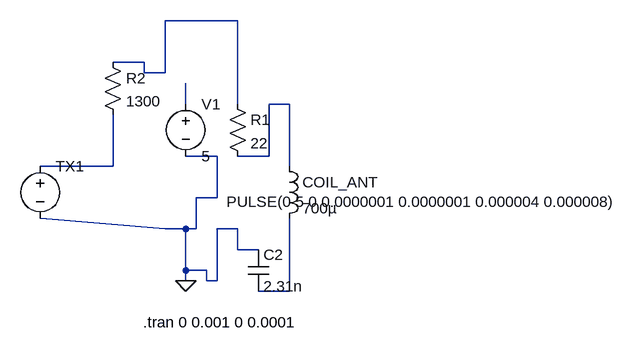
[diagram p0: schematic RLC_Imp.asc]
RLC_Imp.asc, the LTspice schematic file:
Version 4
SHEET 1 1072 680
WIRE 160 -224 48 -224
WIRE 16 -160 -32 -160
WIRE 16 -144 16 -160
WIRE 48 -144 48 -224
WIRE 48 -144 16 -144
WIRE 80 -96 80 -128
WIRE 160 -96 160 -224
WIRE 240 -96 208 -96
WIRE 128 -16 80 -16
WIRE 208 -16 208 -96
WIRE 208 -16 160 -16
WIRE -32 0 -32 -80
WIRE -32 0 -144 0
WIRE 240 0 240 -96
WIRE 128 48 128 -16
WIRE 128 48 96 48
WIRE 48 96 -144 80
WIRE 80 96 48 96
WIRE 96 96 96 48
WIRE 96 96 80 96
WIRE 160 96 128 96
WIRE 160 128 160 96
WIRE 192 128 160 128
WIRE 80 160 80 96
WIRE 112 160 80 160
WIRE 80 176 80 160
WIRE 112 176 112 160
WIRE 128 176 128 96
WIRE 128 176 112 176
WIRE 240 192 240 80
WIRE 240 192 192 192
FLAG 80 176 0
SYMBOL ind 224 -16 R0
SYMATTR InstName COIL_ANT
SYMATTR Value 700µ
SYMBOL voltage -144 -16 R0
WINDOW 3 287 70 Left 2
WINDOW 123 0 0 Left 2
WINDOW 39 0 0 Left 2
SYMATTR InstName TX1
SYMATTR Value PULSE(0 5 0 0.0000001 0.0000001 0.000004 0.000008)
SYMBOL cap 176 128 R0
SYMATTR InstName C2
SYMATTR Value 2.31n
SYMBOL res 144 -112 R0
SYMATTR InstName R1
SYMATTR Value 22
SYMBOL res -48 -176 R0
SYMATTR InstName R2
SYMATTR Value 1300
SYMBOL voltage 80 -112 R0
SYMATTR InstName V1
SYMATTR Value 5
TEXT 14 240 Left 2 !.tran 0 0.001 0 0.0001

The netlist it stands for:
* RLC_Imp.asc
L§COIL_ANT N003 N005 700µ
V§TX1 N004 0 PULSE(0 5 0 0.0000001 0.0000001 0.000004 0.000008)
C2 0 N005 2.31n
R1 N001 N003 22
R2 N001 N004 1300
V1 N002 0 5
.tran 0 0.001 0 0.0001
.backanno
.end